# EAGLE schematic transistor-board (EAGLE 6.4)
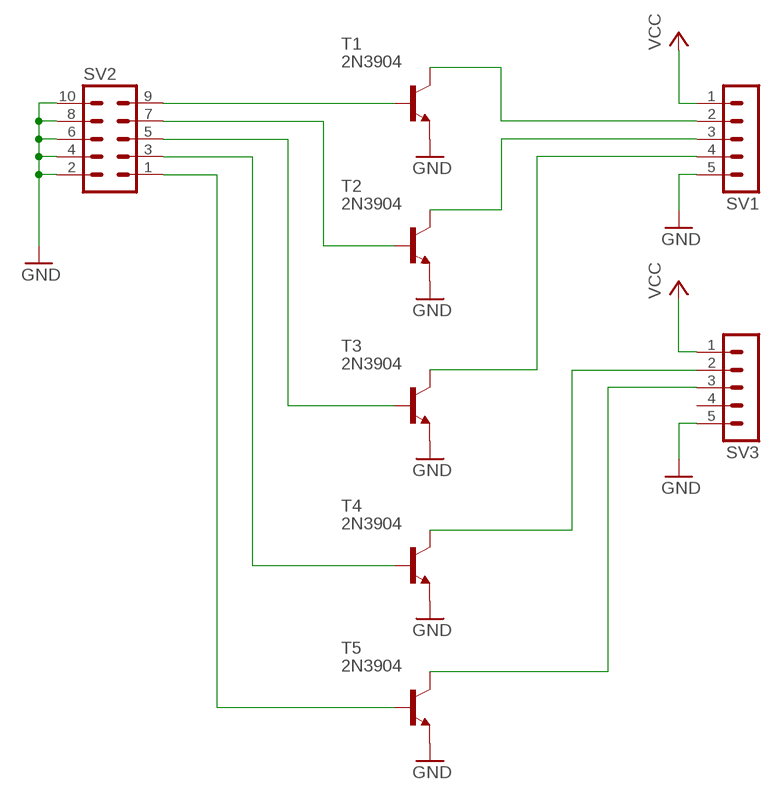
[diagram p0: schematic, sheet 1]

## Parts
SV1  MA05-1  [MA05-1]
SV2  MA05-2  [MA05-2]
SV3  MA05-1  [MA05-1]
T1  2N3904  [TO92]
T2  2N3904  [TO92]
T3  2N3904  [TO92]
T4  2N3904  [TO92]
T5  2N3904  [TO92]

## Nets
GND: SV1.5 SV2.2 SV2.4 SV2.6 SV2.8 SV2.10 SV3.5 T1.3(E) T2.3(E) T3.3(E) T4.3(E) T5.3(E)
N$1: SV3.2 T4.1(C)
N$2: SV2.9 T1.2(B)
N$3: SV1.4 T3.1(C)
N$4: SV1.2 T1.1(C)
N$5: SV1.3 T2.1(C)
N$6: SV2.7 T2.2(B)
N$7: SV2.5 T3.2(B)
N$8: SV2.3 T4.2(B)
N$9: SV2.1 T5.2(B)
N$10: SV3.3 T5.1(C)
VCC: SV1.1 SV3.1
Unconnected: SV3.4

## Library data of the parts
SV1 SV3 = con-lstb:MA05-1: PIN HEADER; OC_FARNELL: unknown; OC_NEWARK: unknown
SV2 = con-lstb:MA05-2: PIN HEADER; OC_FARNELL: unknown; OC_NEWARK: unknown
T1-T5 = transistor:2N3904: NPN TRANSISTOR